# Altium schematic sheet AirScout_SchematicsV0_Spannungsversorgung.SchDoc
size A3; SheetNumber: 1; SheetTotal: 1
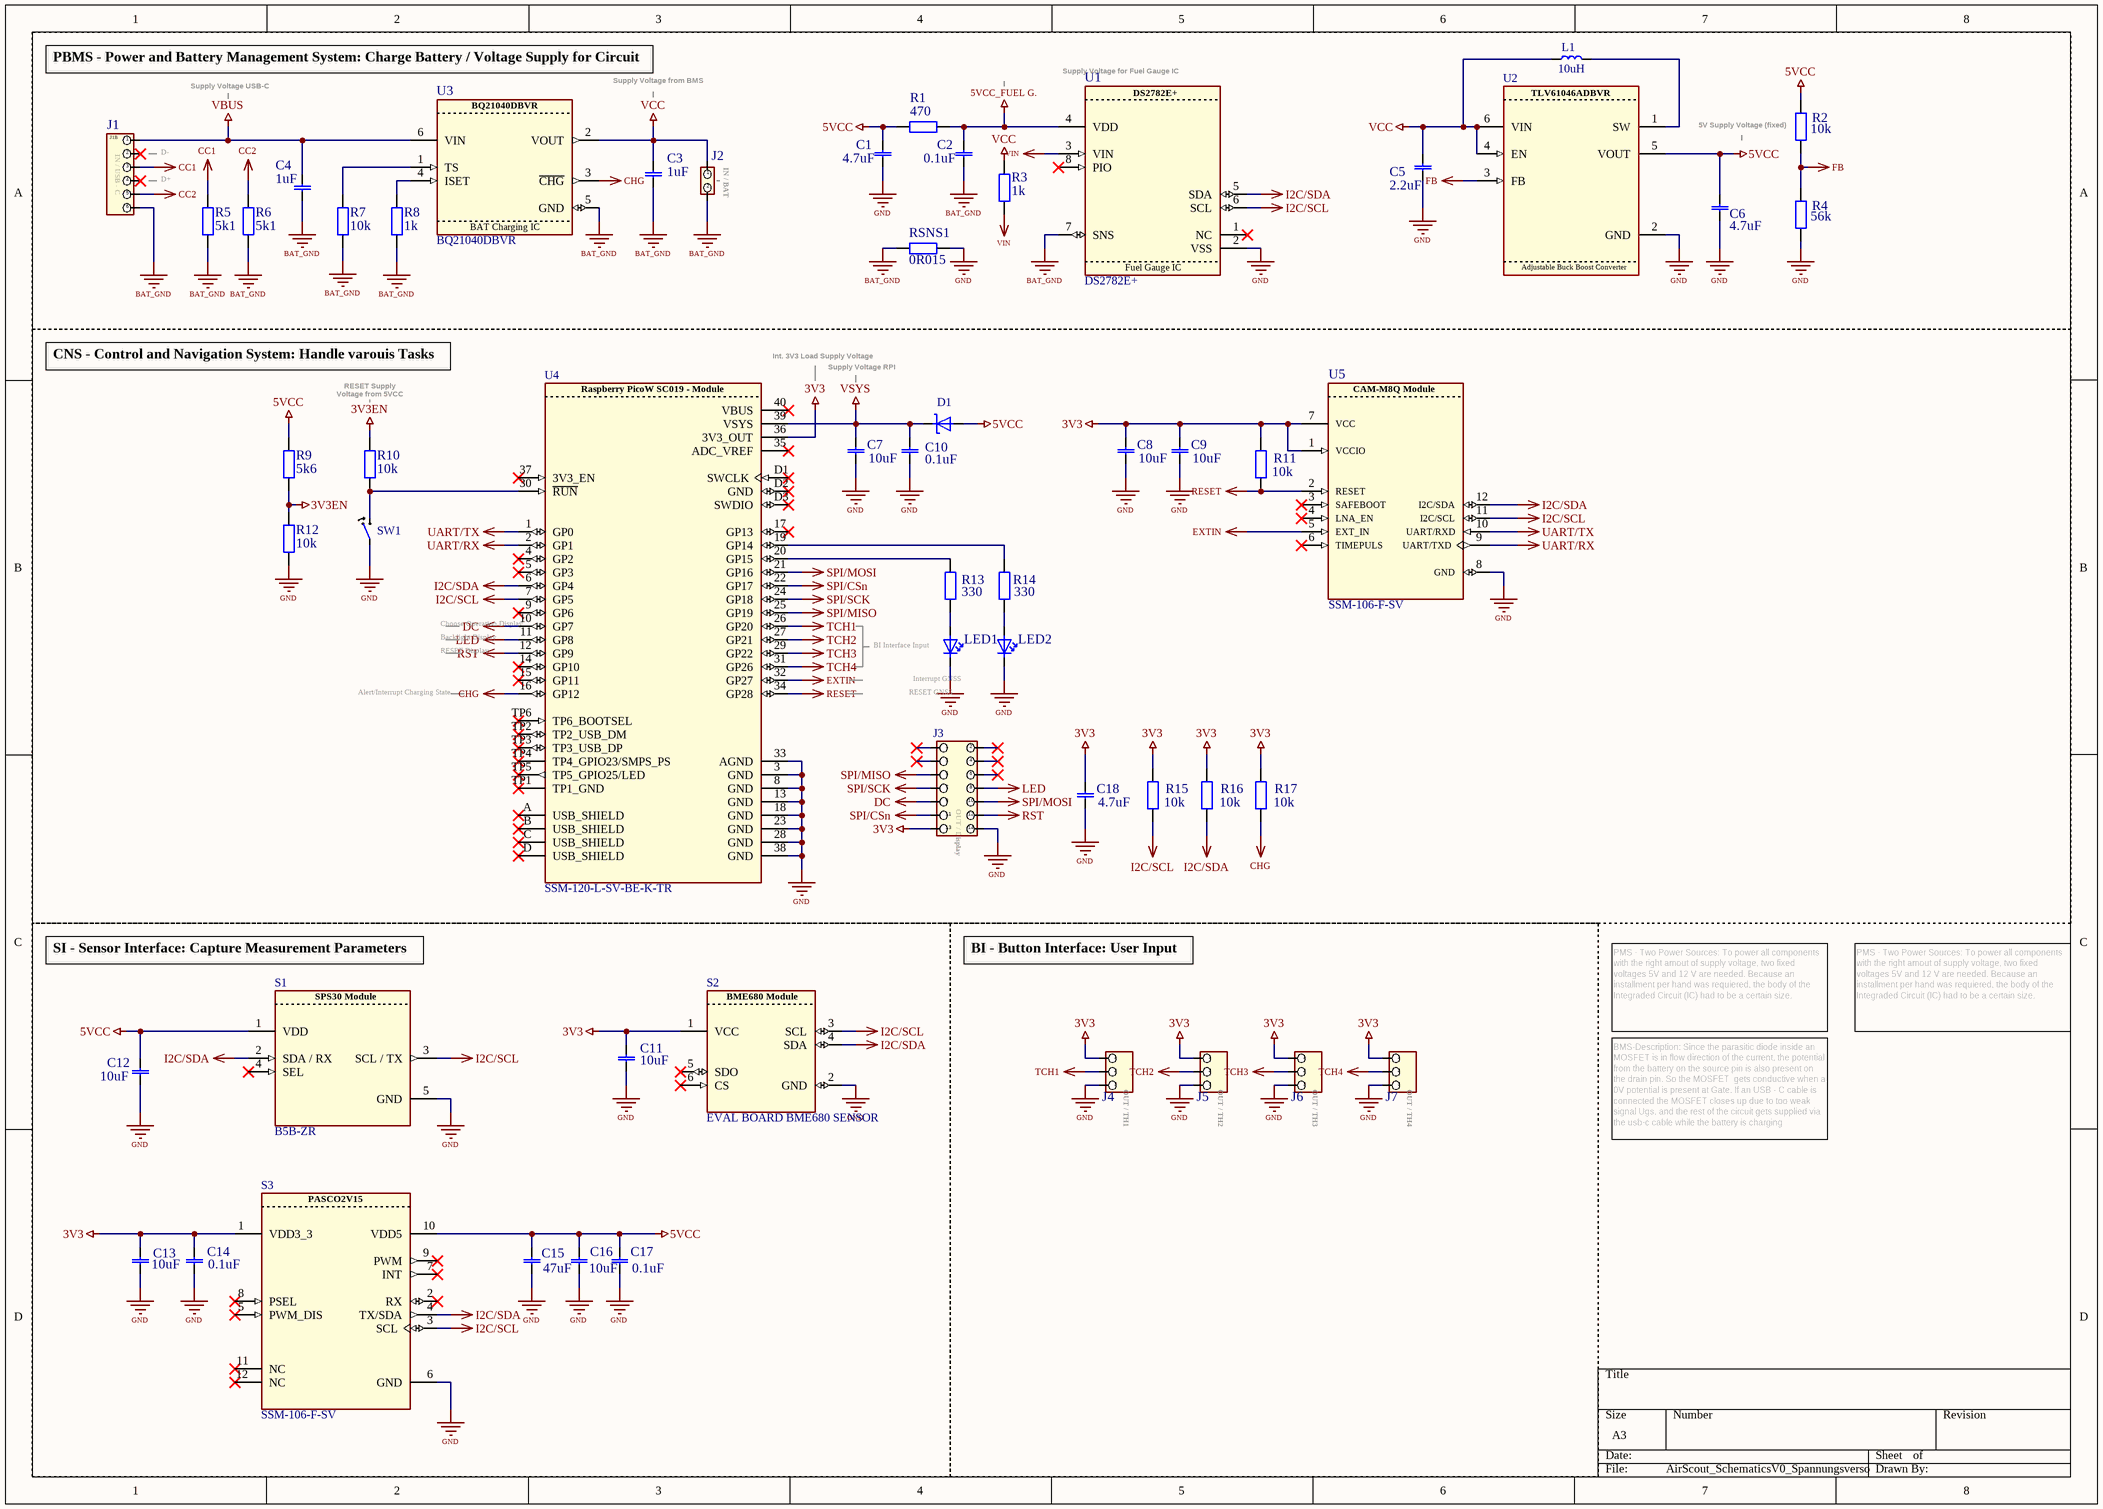
[diagram p0: AirScout_SchematicsV0_Spannungsversorgung.SchDoc]

## Parts
C1  value 4.7uF  [CAPC340180_140N_KEM]  (hidden comment: CL31B475KBHNFNE)
C2  value 0.1uF  [CAPC340180_140N_KEM]  (hidden comment: C1206C104K5RACTU)
C3  value 1uF  [CAPC340180_140N_KEM]  (hidden comment: C1206C105K3RACTU)
C4  value 1uF  [CAPC340180_140N_KEM]  (hidden comment: C1206C105K3RACTU)
C5  value 2.2uF  [CAPC340180_140N_KEM]  (hidden comment: CL31B225KBHNNNE)
C6  value 4.7uF  [CAPC340180_140N_KEM]  (hidden comment: CL31B475KBHNFNE)
C7  value 10uF  [CAPC340180_140N_KEM]  (hidden comment: CL31B106KAHNNNE)
C8  value 10uF  [CAPC340180_140N_KEM]  (hidden comment: CL31B106KAHNNNE)
C9  value 10uF  [CAPC340180_140N_KEM]  (hidden comment: CL31B106KAHNNNE)
C10  value 0.1uF  [CAPC340180_140N_KEM]  (hidden comment: C1206C104K5RACTU)
C11  value 10uF  [CAPC340180_140N_KEM]  (hidden comment: CL31B106KAHNNNE)
C12  value 10uF  [CAPC340180_140N_KEM]  (hidden comment: CL31B106KAHNNNE)
C13  value 10uF  [CAPC340180_140N_KEM]  (hidden comment: CL31B106KAHNNNE)
C14  value 0.1uF  [CAPC340180_140N_KEM]  (hidden comment: C1206C104K5RACTU)
C15  value 47uF  [CAPC340180_140N_KEM]  (hidden comment: CL31B106KAHNNNE)
C16  value 10uF  [CAPC340180_140N_KEM]  (hidden comment: CL31B106KAHNNNE)
C17  value 0.1uF  [CAPC340180_140N_KEM]  (hidden comment: C1206C104K5RACTU)
C18  value 4.7uF  [CAPC340180_140N_KEM]  (hidden comment: CL31B475KBHNFNE)
D1  B240A-13-F  [DIOM5226X230N]  (value not drawn)
J1  B6B-PH-K-S  [JST_B6B-PH-K-S]  (value not drawn)
J2  B02B-PASK-1  [JST_B2B-PH-K-S]  (value not drawn)
J3  0705430013  [CONN_SDA-70543-XXXX_14_MOL]  (value not drawn)
J4  0705430002  [MOLEX_70543-0037]  (value not drawn)
J5  0705430002  [MOLEX_70543-0037]  (value not drawn)
J6  0705430002  [MOLEX_70543-0037]  (value not drawn)
J7  0705430002  [MOLEX_70543-0037]  (value not drawn)
L1  value 10uH  [IND_FDSD0420-H-100M=P3]  (hidden comment: FDSD0420-H-100M=P3)
LED1  LTST-C150GKT  [LED_LTST-C150GKT_LTO]  (value not drawn)
LED2  LTST-C150KRKT  [LED_LTST-C150GKT_LTO]  (value not drawn)
R1  value 470  [RESC3116X65N]  (hidden comment: CRGCQ1206F470R)
R2  value 10k  [RESC3116X65N]  (hidden comment: RC1206FR-0710KL)
R3  value 1k  [RESC3116X65N]  (hidden comment: RNCP1206FTD1K00)
R4  value 56k  [RESC3116X65N]  (hidden comment: RMCF1206JT56K0)
R5  value 5k1  [RESC3116X65N]  (hidden comment: RMCF1206JT5K10)
R6  value 5k1  [RESC3116X65N]  (hidden comment: RMCF1206JT5K10)
R7  value 10k  [RESC3116X65N]  (hidden comment: RC1206FR-0710KL)
R8  value 1k  [RESC3116X65N]  (hidden comment: RC1206FR-0710KL)
R9  value 5k6  [RESC3116X65N]  (hidden comment: RC1206JR-075K6L)
R10  value 10k  [RESC3116X65N]  (hidden comment: RC1206FR-0710KL)
R11  value 10k  [RESC3116X65N]  (hidden comment: RC1206FR-0710KL)
R12  value 10k  [RESC3116X65N]  (hidden comment: RC1206FR-0710KL)
R13  value 330  [RESC3116X65N]  (hidden comment: RMCF1206JT330R)
R14  value 330  [RESC3116X65N]  (hidden comment: RMCF1206JT330R)
R15  value 10k  [RESC3116X65N]  (hidden comment: RC1206FR-0710KL)
R16  value 10k  [RESC3116X65N]  (hidden comment: RC1206FR-0710KL)
R17  value 10k  [RESC3116X65N]  (hidden comment: RC1206FR-0710KL)
RSNS1  value 0R015  [RESC3116X65N]  (hidden comment: WSL1206R0150FEA)
S1  B5B-ZR  [CONN5_B5B-ZR_JST]
S2  EVAL BOARD BME680 SENSOR  [PIM357]
S3  SSM-106-F-SV  [IFX-SMD-LG-MLGA-14-1-V_MODUL]
SW1  Y97KT23B2NAFP  [SW_PTS647SM38SMTR2LFS_CNK]  (value not drawn)
U1  DS2782E+  [SOP65P640X110-8N]
U2  TLV61046ADBVR  [DBV0006A_M]  (value not drawn)
U3  BQ21040DBVR  [SOT95P280X145-6N]
U4  SSM-120-L-SV-BE-K-TR  [PicoW SC019]
U5  SSM-106-F-SV  [CAM8MQ-Mod]

## Blocks framed on the sheet
CNS - Control and Navigation System: Handle varouis Tasks: C7-C10 C18 D1 J3 LED1 LED2 R9-R17 SW1 U4 U5
SI - Sensor Interface: Capture Measurement Parameters: C11-C17 S1-S3
BI - Button Interface: User Input: J4-J7

## Nets
3V3: C8.1 C9.1 C11.1 C13.1 C14.1 C18.1 J3.13 J4.1 J5.1 J6.1 J7.1 R11.2 R15.2 R16.1 R17.1 S2.1(VCC) S3.1(VDD3_3) U4.36(3V3_OUT) U5.1(VCCIO) U5.7(VCC)
3V3EN: R9.1 R10.2 R12.2
5VCC: C1.1 C6.2 C12.1 C15.1 C16.1 C17.1 D1.A R1.1 R2.2 R9.2 S1.1(VDD) S3.10(VDD5) U2.5(VOUT)
5VCC_FUEL G.: C2.1 R1.2 U1.4(VDD)
BAT_GND: C2.2 C3.2 C4.2 J1.6 J2.2(-) R5.1 R6.1 R7.1 R8.1 RSNS1.2 U1.7(SNS) U3.5(GND)
CC1: J1.3 R5.2
CC2: J1.5 R6.2
CHG: R17.2 U3.3(~{CHG}) U4.16(GP12)
DC: J3.9 U4.10(GP7)
EXTIN: U4.32(GP27) U5.5(EXT_IN)
FB: R2.1 R4.2 U2.3(FB)
GND: C1.2 C5.1 C6.1 C7.2 C8.2 C9.2 C10.2 C11.2 C12.2 C13.2 C14.2 C15.2 C16.2 C17.2 C18.2 J3.14 J4.3 J5.3 J6.3 J7.3 LED1.2(K) LED2.2(K) R4.1 R12.1 RSNS1.1 S1.5(GND) S2.2(GND) S3.6(GND) SW1.1 U1.2(VSS) U2.2(GND) U4.3(GND) U4.8(GND) U4.13(GND) U4.18(GND) U4.23(GND) U4.28(GND) U4.33(AGND) U4.38(GND) U5.8(GND)
I2C/SCL: R15.1 S1.3(SCL_/_TX) S2.3(SCL) S3.3(SCL) U1.6(SCL) U4.7(GP5) U5.11(I2C/SCL)
I2C/SDA: R16.2 S1.2(SDA_/_RX) S2.4(SDA) S3.4(TX/SDA) U1.5(SDA) U4.6(GP4) U5.12(I2C/SDA)
LED: J3.8 U4.11(GP8)
RESET: R11.1 U4.34(GP28) U5.2(RESET)
RST: J3.12 U4.12(GP9)
SPI/CSn: J3.11 U4.22(GP17)
SPI/MISO: J3.5 U4.25(GP19)
SPI/MOSI: J3.10 U4.21(GP16)
SPI/SCK: J3.7 U4.24(GP18)
TCH1: J4.2 U4.26(GP20)
TCH2: J5.2 U4.27(GP21)
TCH3: J6.2 U4.29(GP22)
TCH4: J7.2 U4.31(GP26)
UART/RX: U4.2(GP1) U5.9(UART/TXD)
UART/TX: U4.1(GP0) U5.10(UART/RXD)
VBUS: C4.1 J1.1 U3.6(VIN)
VCC: C3.1 C5.2 J2.1(+) L1.1 R3.2 U2.4(EN) U2.6(VIN) U3.2(VOUT)
VIN: R3.1 U1.3(VIN)
VSYS: C7.1 C10.1 D1.K U4.39(VSYS)
NetL1_2: L1.2 U2.1(SW)
NetLED1_1: LED1.1(A) R13.1
NetLED2_1: LED2.1(A) R14.1
NetR7_2: R7.2 U3.1(TS)
NetR8_2: R8.2 U3.4(ISET)
NetR10_1: R10.1 SW1.2 U4.30(~{RUN})
NetR13_2: R13.2 U4.20(GP15)
NetR14_2: R14.2 U4.19(GP14)

Not connected (* = marked no-connect by the designer): J1 2* 4*; J3 1* 2* 3* 4* 6*; S1 4(SEL)*; S2 5(SDO)* 6(CS)*; S3 2(RX)* 5(PWM_DIS)* 7(INT)* 8(PSEL)* 9(PWM)* 11(NC)* 12(NC)*; U1 1(NC)* 8(PIO)*; U4 4(GP2)* 5(GP3)* 9(GP6)* 14(GP10)* 15(GP11)* 17(GP13)* 35(ADC_VREF)* 37(3V3_EN)* 40(VBUS)* A(USB_SHIELD)* B(USB_SHIELD)* C(USB_SHIELD)* D(USB_SHIELD)* D1(SWCLK)* D2(GND)* D3(SWDIO)* TP1(TP1_GND)* TP2(TP2_USB_DM)* TP3(TP3_USB_DP)* TP4(TP4_GPIO23/SMPS_PS)* TP5(TP5_GPIO25/LED)* TP6(TP6_BOOTSEL)*; U5 3(SAFEBOOT)* 4(LNA_EN)* 6(TIMEPULS)*

## Notes on the sheet
- PBMS - Power and Battery Management System: Charge Battery / Voltage Supply for Circuit
- Supply Voltage USB-C
- Supply Voltage from BMS
- Supply Voltage for Fuel Gauge IC
- (near J1) J1B
- (near J1) IN / USB - C
- (near J1) D-
- (near J1) D+
- (near J2) IN / BAT
- (near R2) 5V Supply Voltage (fixed)
- (near U4) Int. 3V3 Load Supply Voltage
- Supply Voltage RPI
- RESET Supply Voltage from 5VCC
- RESET Display
- Backlight Display
- Choose Operation Display
- (near LED1) BI Interface Input
- Alert/Interrupt Charging State
- RESET GNSS
- (near LED1) Interrupt GNSS
- (near J3) OUT / Display
- PMS - Two Power Sources: To power all components with the right amout of supply voltage, two fixed voltages 5V and 12 V are needed. Because an installment per hand was requiered, the body of the Integraded Circuit (IC) had to be a certain size.
- (near J4) OUT / TH1
- (near J5) OUT / TH2
- (near J6) OUT / TH3
- (near J7) OUT / TH4
- BMS-Description: Since the parasitic diode inside an MOSFET is in flow direction of the current, the potential from the battery on the source pin is also present on the drain pin. So the MOSFET  gets conductive when a 0V potential is present at Gate. If an USB - C cable is connected the MOSFET closes up due to too weak signal Ugs, and the rest of the circuit gets supplied via the usb-c cable while the battery is charging
- (in symbol BQ21040DBVR) BAT Charging IC
- (in symbol DS2782E+) Fuel Gauge IC
- (in symbol PASCO2V15 Module) PASCO2V15
- (in symbol Raspberry PicoW SC019 Module) Raspberry PicoW SC019 - Module
- (in symbol TLV61046ADBVR) Adjustable Buck Boost Converter

## Library data of the parts
C1 C6 C18 = CAP: CAP CER 4.7UF 50V X7R 1206
C2 C10 C14 C17 = CAP: CAP CER 0.1UF 50V X7R 1206
C3 C4 = CAP: CAP CER 1UF 25V X7R 1206
C5 = CAP: CAP CER 2.2UF 50V X7R 1206
C7-C9 C11-C13 C15 C16 = CAP: CAP CER 10UF 25V X7R 1206
D1 = Diode-Schottky: DIODE SCHOTTKY 40V 2A SMA
J1 = CON6x1: CONN HEADER VERT 6POS 2MM
J2 = CON2x1_vertical: CONN HEADER VERT 2POS 2MM
J3 = CON7x2: CONN HEADER VERT 14POS 2.54MM
J4-J7 = CON 3x1: CONN HEADER VERT 3POS 2.54MM
L1 = Inductor: FIXED IND 10UH 1.7A 200 MOHM SMD
LED1 = LED: LED GREEN CLEAR 1206 SMD
LED2 = LED: LED RED CLEAR 1206 SMD
R1 = RES: RES 470 OHM 1% 1/4W 1206
R2 R7 R8 R10-R12 R15-R17 = RES: RES 10K OHM 1% 1/4W 1206
R3 = RES: RES 1K OHM 1% 1/2W 1206
R4 = RES: RES 56K OHM 5% 1/4W 1206
R5 R6 = RES: RES 5.1K OHM 5% 1/4W 1206
R9 = RES: RES 5.6K OHM 5% 1/4W 1206
R13 R14 = RES: RES 330 OHM 5% 1/4W 1206
RSNS1 = RES: RES 0.015 OHM 1% 1/4W 1206
S1 = SPS30 Module: Plug: CONN HEADER VERT 5POS 1.5MM; Air Sensor Dust Sensor Box SPS30 Module: 1649-1106-ND; ComponentLink1Description: Datasheet; ComponentLink1URL: https://sensirion.com/media/documents/8600FF88/64A3B8D6/Sensirion_PM_Sensors_Datasheet_SPS30.pdf; ComponentLink2Description: EU Component; ComponentLink2URL: https://www.digikey.at/en/products/detail/sensirion-ag/SPS30/9598990?gclsrc=aw.ds&gad_source=1&gad_campaignid=9415055229&gbraid=0AAAAADrbLlghU28cdFM9RQIiS448Os4NQ&gclid=Cj0KCQjwzt_FBhCEARIsAJGFWVladtv1vxGMu0RXHFTM9ng6qsDvV838Q-BR2Fl5FYFzWahIkC0y_aYaAqE3EALw_wcB
S2 = BME680 Module: BME680 - Gas, Feuchtigkeit, Druck, Temperatur Evaluierungsboards - Sensoren; ComponentLink1Description: Datasheet; ComponentLink1URL: chrome-extension://efaidnbmnnnibpcajpcglclefindmkaj/https://mm.digikey.com/Volume0/opasdata/d220001/medias/docus/854/PIM357_Web.pdf
S3 = PASCO2V15 Module: (2x) CONN RCPT 6POS 0.1 GOLD SMD; Sensor: EVALCO25VMINIBOARDTOBO1; EVAL BOARD; Symbol Type: XENSIV PAS CO2 1.5; Alternate View: No; Multiple Parts: No; ComponentLink1Description: Datasheet; ComponentLink1URL: chrome-extension://efaidnbmnnnibpcajpcglclefindmkaj/https://www.infineon.com/assets/row/public/documents/24/49/infineon-pasco2v01-datasheet-en.pdf?fileId=8ac78c8c80027ecd01809278f1af1ba2
SW1 = Switch: SWITCH TACTILE SPST-NO 0.05A 12V
U1 = DS2782E+: UVP (Undervoltageprotection), Battery Battery Monitor IC Lithium Ion/Polymer 8-TSSOP; Package: None; Price: None; Value: *; MP: DS2782E+; Availability: Unavailable
U2 = TLV61046ADBVR: 28-V Output Voltage Boost Converter with Power Diode and Isolation Switch 6-SOT-23 -40 to 125; Manufacturer_Name: Texas Instruments; TYPE: TYPE; RefDes: RefDes; Copyright: Copyright (C) 2025 Ultra Librarian. All rights reserved.; Manufacturer_Part_Number: TLV61046ADBVR
U3 = BQ21040DBVR: OVP (Over-Voltage-Protection), SCP (Short-Circuit- Protection), OTP (Over - Temp. - Prot.); 1-cell, 0.8-A Li-ion and Li-polymer battery charger; MF: Texas Instruments; SnapEDA_Link: https://www.snapeda.com/parts/BQ21040DBVR/Texas+Instruments/view-part/?ref=snap; Package: SOT-23-6 Texas Instruments; Value: *; MP: BQ21040DBVR; Check_prices: https://www.snapeda.com/parts/BQ21040DBVR/Texas+Instruments/view-part/?ref=eda
U4 = Raspberry PicoW SC019 Module: (2x) CONN RCPT 20POS 0.1 GOLD SMD; PicoW: SC0918; RASPBERRY PI PICO W RP2040; ComponentLink1Description: EU Component; ComponentLink1URL: https://www.reichelt.at/at/de/shop/produkt/raspberry_pi_pico_rp2040_cortex-m0_microusb-295706; ComponentLink2Description: Datasheet; ComponentLink2URL: chrome-extension://efaidnbmnnnibpcajpcglclefindmkaj/https://datasheets.raspberrypi.com/picow/pico-w-datasheet.pdf
U5 = CAM-M8Q Module: (2x) CONN RCPT 6POS 0.1 GOLD SMD; GPS - Module:  201880; CAM-M8Q-BREAKOUT MULTI GNSS MODU; ComponentLink1Description: Datasheet IC; ComponentLink1URL: chrome-extension://efaidnbmnnnibpcajpcglclefindmkaj/https://content.u-blox.com/sites/default/files/CAM-M8-FW3_DataSheet_%28UBX-15031574%29.pdf